# Altium schematic sheet Schematic.SchDoc: LuckFox Ultra LCD shield
size A3; DrawnBy: Dang Vi Tin; SheetNumber: 1; SheetTotal: 1
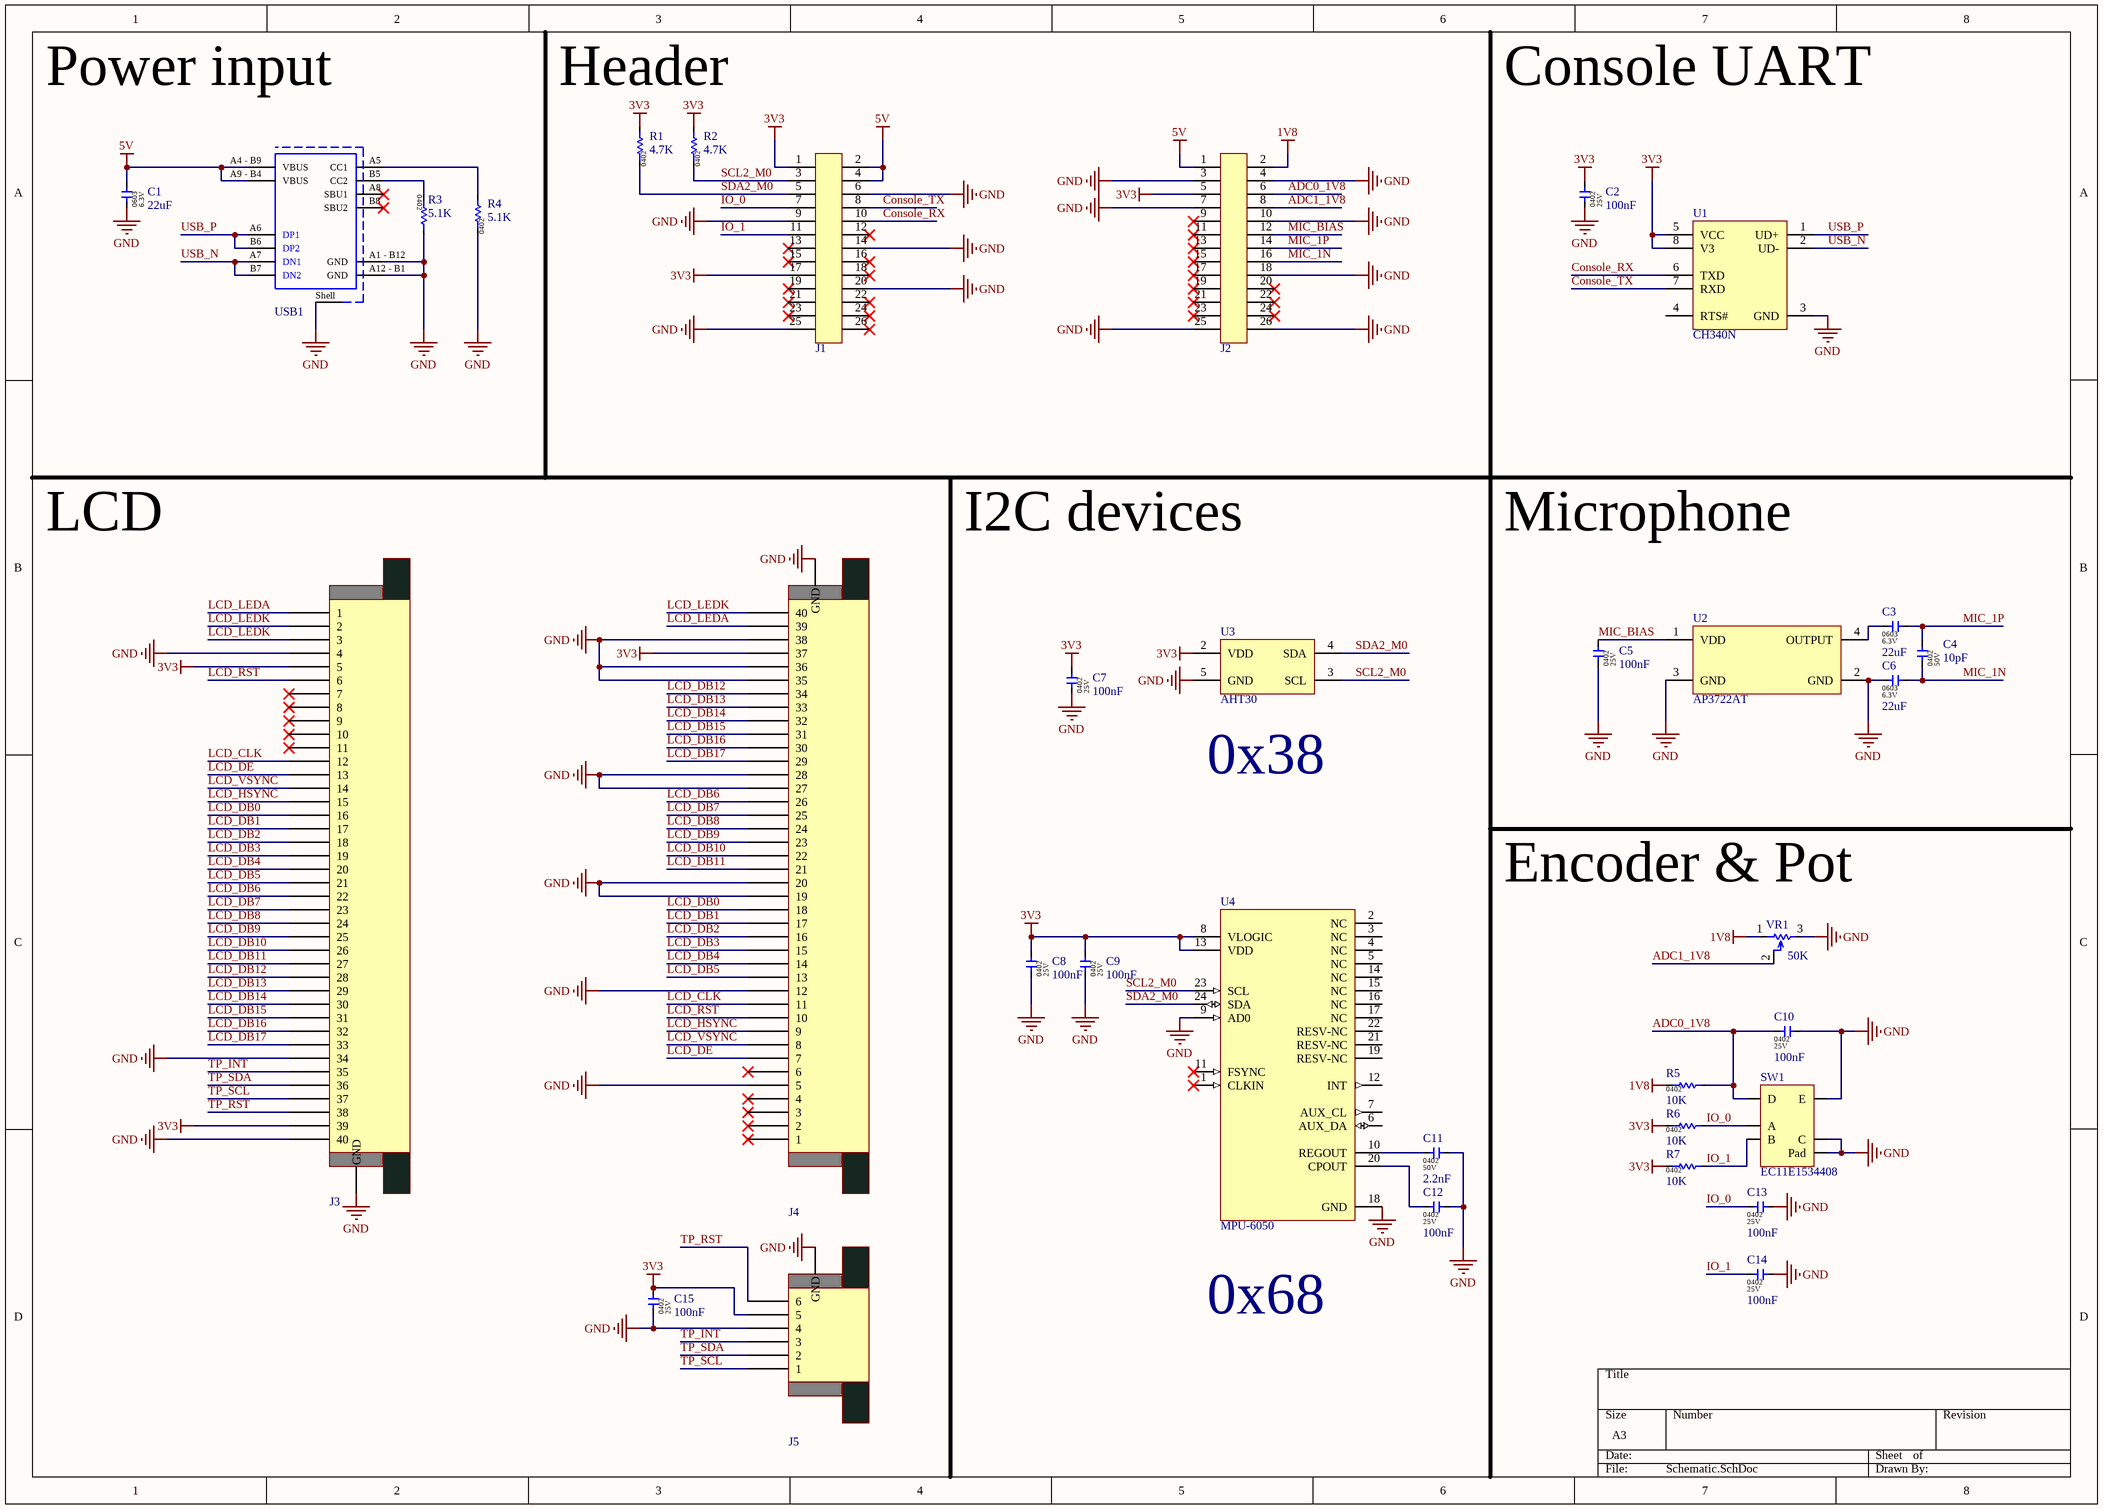
[diagram p0: Schematic.SchDoc]

## Parts
C1  22uF  [CAP-0603]
C2  100nF  [CAP-0402]
C3  22uF  [CAP-0603]
C4  10pF  [CAP-0402]
C5  100nF  [CAP-0402]
C6  22uF  [CAP-0603]
C7  100nF  [CAP-0402]
C8  100nF  [CAP-0402]
C9  100nF  [CAP-0402]
C10  100nF  [CAP-0402]
C11  2.2nF  [CAP-0402]
C12  100nF  [CAP-0402]
C13  100nF  [CAP-0402]
C14  100nF  [CAP-0402]
C15  100nF  [CAP-0402]
J1  PZ254V-12-26P  [Conn 26P-2x13P-2.54H]  (value not drawn)
J2  PZ254V-12-26P  [Conn 26P-2x13P-2.54H]  (value not drawn)
J3  AFC07-S40ECC-00  [FPC - 40P, 0.5mm, top]  (value not drawn)
J4  AFC07-S40FCC-00  [FPC - 40P, 0.5mm, bot]  (value not drawn)
J5  AFC07-S06ECC-00  [FPC-6P-0.5-TOP]  (value not drawn)
R1  4.7K  [RES-0402]
R2  4.7K  [RES-0402]
R3  5.1K  [RES-0402]
R4  5.1K  [RES-0402]
R5  10K  [RES-0402]
R6  10K  [RES-0402]
R7  10K  [RES-0402]
SW1  EC11E1534408  [EC11]
U1  CH340N  [SOP-8]
U2  AP3722AT  [AP3722AT]
U3  AHT30  [AHT30]
U4  MPU-6050  [QFN24-4x4MM]
USB1  918-418K2023S40001  [1 FEMALE USB -C 16]  (value not drawn)
VR1  50K  [Vertical Potentiometer type 1]

## Nets
1V8: J2.2 R5.1 VR1.1
3V3: C2.2 C7.2 C8.2 C9.2 C15.2 J1.1 J1.17 J2.5 J3.5 J3.39 J4.37 J5.5 R1.2 R2.2 R6.1 R7.1 U1.5(VCC) U1.8(V3) U3.2(VDD) U4.8(VLOGIC) U4.13(VDD)
5V: C1.2 J1.2 J1.4 J2.1 USB1.A4_-_B9(VBUS) USB1.A9_-_B4(VBUS)
GND: C1.1 C2.1 C5.1 C6.1 C7.1 C8.1 C9.1 C10.2 C11.2 C12.2 C13.2 C14.2 C15.1 J1.6 J1.9 J1.14 J1.20 J1.25 J2.3 J2.4 J2.7 J2.10 J2.18 J2.25 J2.26 J3.0(GND) J3.4 J3.34 J3.40 J4.0(GND) J4.5 J4.12 J4.19 J4.20 J4.27 J4.28 J4.35 J4.36 J4.38 J5.0(GND) J5.4 R3.2 R4.1 SW1.0(Pad) SW1.C SW1.E U1.3(GND) U2.2(GND) U2.3(GND) U3.5(GND) U4.9(AD0) U4.18(GND) USB1.A1_-_B12(GND) USB1.A12_-_B1(GND) USB1.Shell(Shield) VR1.3
ADC0_1V8: C10.1 J2.6 R5.2 SW1.D
ADC1_1V8: J2.8 VR1.2
Console_RX: J1.10 U1.6(TXD)
Console_TX: J1.8 U1.7(RXD)
IO_0: C13.1 J1.7 R6.2 SW1.A
IO_1: C14.1 J1.11 R7.2 SW1.B
LCD_CLK: J3.12 J4.11
LCD_DB0: J3.16 J4.18
LCD_DB1: J3.17 J4.17
LCD_DB2: J3.18 J4.16
LCD_DB3: J3.19 J4.15
LCD_DB4: J3.20 J4.14
LCD_DB5: J3.21 J4.13
LCD_DB6: J3.22 J4.26
LCD_DB7: J3.23 J4.25
LCD_DB8: J3.24 J4.24
LCD_DB9: J3.25 J4.23
LCD_DB10: J3.26 J4.22
LCD_DB11: J3.27 J4.21
LCD_DB12: J3.28 J4.34
LCD_DB13: J3.29 J4.33
LCD_DB14: J3.30 J4.32
LCD_DB15: J3.31 J4.31
LCD_DB16: J3.32 J4.30
LCD_DB17: J3.33 J4.29
LCD_DE: J3.13 J4.7
LCD_HSYNC: J3.15 J4.9
LCD_LEDA: J3.1 J4.39
LCD_LEDK: J3.2 J3.3 J4.40
LCD_RST: J3.6 J4.10
LCD_VSYNC: J3.14 J4.8
MIC_1N: C4.1 C6.2 J2.16
MIC_1P: C3.2 C4.2 J2.14
MIC_BIAS: C5.2 J2.12 U2.1(VDD)
SCL2_M0: J1.3 R2.1 U3.3(SCL) U4.23(SCL)
SDA2_M0: J1.5 R1.1 U3.4(SDA) U4.24(SDA)
TP_INT: J3.35 J5.3
TP_RST: J3.38 J5.6
TP_SCL: J3.37 J5.1
TP_SDA: J3.36 J5.2
USB_N: U1.2(UD-) USB1.A7(DN1) USB1.B7(DN2)
USB_P: U1.1(UD+) USB1.A6(DP1) USB1.B6(DP2)
NetC3_1: C3.1 U2.4(OUTPUT)
NetC11_1: C11.1 U4.10(REGOUT)
NetC12_1: C12.1 U4.20(CPOUT)
NetR3_1: R3.1 USB1.B5(CC2)
NetR4_2: R4.2 USB1.A5(CC1)

Not connected (* = marked no-connect by the designer): J1 12* 13* 15* 16* 18* 19* 21* 22* 23* 24* 26*; J2 9* 11* 13* 15* 17* 19* 20* 21* 22* 23* 24*; J3 7* 8* 9* 10* 11*; J4 1* 2* 3* 4* 6*; U1 4(RTS#); U4 1(CLKIN)* 2(NC) 3(NC) 4(NC) 5(NC) 6(AUX_DA) 7(AUX_CL) 11(FSYNC)* 12(INT) 14(NC) 15(NC) 16(NC) 17(NC) 19(RESV-NC) 21(RESV-NC) 22(RESV-NC); USB1 A8(SBU1)* B8(SBU2)*

## Notes on the sheet
- Power input
- Header
- Console UART
- LCD
- I2C devices
- Microphone
- (near U3) 0x38
- (near VR1) Encoder & Pot
- 0x68

## Library data of the parts
C1 C3 C6 = 0603X226M6R3CT: 22uF ±20% 6.3V X5R 0603 Multilayer Ceramic Capacitors MLCC - SMD/SMT RoHS; Manufacture: WALSIN; Package / Case: 0402; Component type: Capacitor; Manufacture part: 0603X226M6R3CT; Capacitor value: 22uF; Voltage: 6.3V; Package: 0603
C2 C5 C7-C10 C12-C15 = 0402X104K250CT: 100nF ±10% 25V X5R 0402 Multilayer Ceramic Capacitors MLCC - SMD/SMT RoHS; Manufacture: WALSIN; Package / Case: 0402; Component type: Capacitor; Manufacture part: 0402X104K250CT; Capacitor value: 100nF; Voltage: 25V; Package: 0402
C4 = 0402N100J500CT: 10pF ±5% 50V NP0 0402 Multilayer Ceramic Capacitors MLCC - SMD/SMT RoHS; Manufacture: WALSIN; Package / Case: 0402; Component type: Capacitor; Manufacture part: 0402N100J500CT; Capacitor value: 10pF; Voltage: 50V; Package: 0402
C11 = 0402B222K500CT: 50V 2.2nF X7R ±10% 0402 Multilayer Ceramic Capacitors MLCC - SMD/SMT ROHS; Manufacture: WALSIN; Package / Case: 0402; Component type: Capacitor; Manufacture part: 0402B222K500CT; Capacitor value: 2.2nF; Voltage: 50V; Package: 0402
J1 J2 = PZ254V-12-26P: Pin Header 26 2 Straight，180degrees 2.54mm Through Hole,P=2.54mm Pin Header & Female Header RoHS; Manufacture: XFCN; Manufacture part: PZ254V-12-26P; Type: Pin Header; Datasheet: https://datasheet.lcsc.com/lcsc/2003141409_XFCN-PZ254V-11-02P_C492401.pdf
J3 = AFC07-S40ECC-00: Contact,Top 40 0.020"（0.50mm） 0.079"（2.00mm） Slide Lock 40P FFC, FPC Connectors RoHS; Manufacture: JUSHUO; Manufacture part: AFC07-S40ECC-00; Type: FPC; Datasheet: https://datasheet.lcsc.com/lcsc/JUSHUO-AFC07-S40ECC-00_C11097.pdf
J4 = AFC07-S40FCC-00: Bottom Contact 40 0.020"（0.50mm） 0.079"（2.00mm） Slide Lock 40P FFC, FPC Connectors RoHS; Manufacture: JUSHUO; Manufacture part: AFC07-S40FCC-00; Type: FPC; Datasheet: https://datasheet.lcsc.com/lcsc/JUSHUO-AFC07-S40FCC-00_C11062.pdf
J5 = AFC07-S06ECC-00: Slide Lock Contact,Top 6P (0.50mm) FFC/FPC Connectors ROHS; Manufacture: JUSHUO; Manufacture part: AFC07-S06ECC-00; Type: FPC; Datasheet: https://datasheet.lcsc.com/lcsc/1811021327_JUSHUO-AFC07-S06ECC-00_C11083.pdf
R1 R2 = WR04X4701FTL: 4.7kΩ ±1% 1/16W ±100ppm/℃ 0402 Chip Resistor - Surface Mount RoHS; Manufacture: WALSIN; Package / Case: 0201; Component type: Resistor; Manufacture part: WR04X4701FTL; Resistor value: 4.7K; Package: 0402
R3 R4 = WR04X5101FTL: 5.1kΩ ±1% 1/16W ±100ppm/℃ 0402 Chip Resistor - Surface Mount RoHS; Manufacture: WALSIN; Package / Case: 0201; Component type: Resistor; Manufacture part: WR04X5101FTL; Resistor value: 5.1K; Package: 0402
R5-R7 = WR04X1002FTL: 10kΩ ±1% 1/16W ±100ppm/℃ 0402 Chip Resistor - Surface Mount RoHS; Manufacture: WALSIN; Package / Case: 0201; Component type: Resistor; Manufacture part: WR04X1002FTL; Resistor value: 10K; Package: 0402
SW1 = EC11E1534408: DIP Rotary Encoders; Manufacture: ALPSALPINE; Manufacture part: EC11E1534408; Type: Rotary Encoders; Datasheet: https://datasheet.lcsc.com/lcsc/1809181724_ALPSALPINE-EC11E1534408_C278348.pdf
U1 = CH340N: Transceiver USB 2.0 2Mbps SOP-8 USB ICs RoHS; Manufacture: WCH; Manufacture part: CH340N; Package: SOP-8; Datasheet: https://datasheet.lcsc.com/lcsc/2202231130_WCH-Jiangsu-Qin-Heng-CH340N_C2977777.pdf
U2 = AP3722AT: SMD,3.76x2.24x1.1mm MEMS Microphones ROHS; Manufacture: ALLPOWER(ShenZhen Quan Li Semiconductor); Manufacture part: AP3722AT; Package: N/A; Datasheet: https://datasheet.lcsc.com/lcsc/2011200934_ALLPOWER-ShenZhen-Quan-Li-Semiconductor-AP3722AT_C918198.pdf
U3 = AHT30: I2C Temperature and Humidity Sensor; Manufacture: Aosong; Manufacture part: AHT30; Package: 3x3mm; Datasheet: https://github.com/libdriver/aht30/blob/main/datasheet/aht30_datasheet.pdf
U4 = MPU-6050: 6-axis accelerometer/gyroscope; Manufacture: TDK InvenSense; Manufacture part: MPU-6050; Package: QFN-24 (4x4); Datasheet: https://datasheet.lcsc.com/lcsc/1811071024_TDK-InvenSense-MPU-6050_C24112.pdf
USB1 = 918-418K2023S40001: USB - Type C Female 16 SMD USB Connectors RoHS; Manufacture: Jing Extension of the Electronic Co.; Manufacture part: 918-418K2023S40001; Type: USB-C; Datasheet: https://datasheet.lcsc.com/lcsc/2103051833_Jing-Extension-of-the-Electronic-Co-918-418K2023S40001_C167321.pdf
VR1 = RK09D1130C4G: 20V ±20% 50mW 50kΩ Plugin Variable Resistors/Potentiometers ROHS; Manufacture: ALPSALPINE; Manufacture part: RK09D1130C4G; Resistor value: 50K; Package: Potentiometer